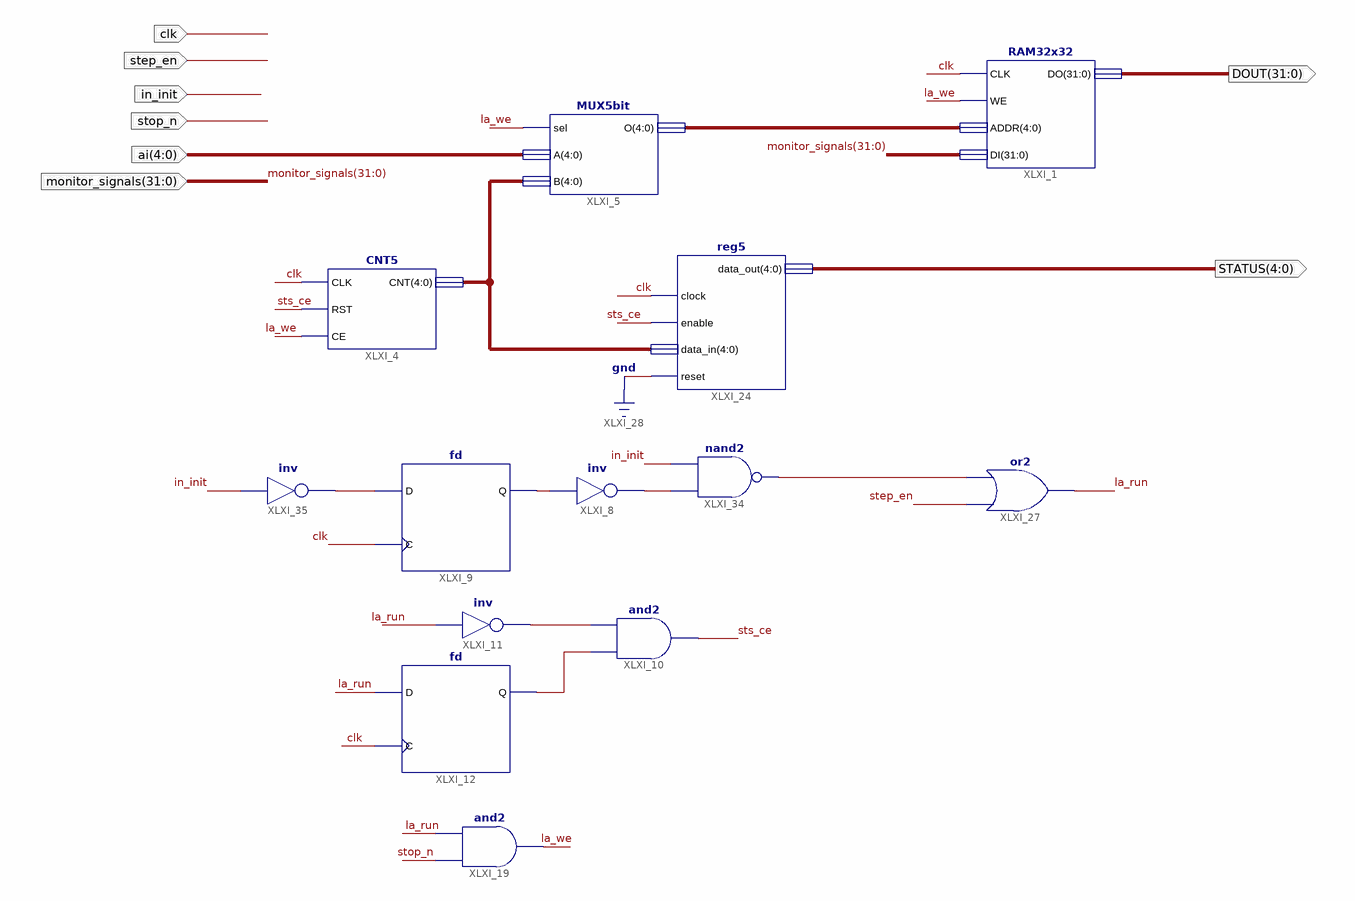
[diagram p0: schematic sheet 1]
// Xilinx ISE schematic LA.sch (spartan6) as structural Verilog: 13 symbols, 8 ports
module LA (
  input  in_init,
  input  step_en,
  input  [4:0] ai,
  input  stop_n,
  input  [31:0] monitor_signals,
  input  clk,
  output [31:0] DOUT,
  output [4:0] STATUS
);

  wire la_run, la_we, sts_ce, XLXN_31, XLXN_35, XLXN_41, XLXN_42, XLXN_63, XLXN_67;
  wire [4:0] XLXN_16, XLXN_17;

  RAM32x32 XLXI_1 (.CLK(clk), .WE(la_we), .ADDR(XLXN_17), .DI(monitor_signals), .DO(DOUT));
  CNT5 XLXI_4 (.CLK(clk), .RST(sts_ce), .CE(la_we), .CNT(XLXN_16));
  MUX5bit XLXI_5 (.sel(la_we), .A(ai), .B(XLXN_16), .O(XLXN_17));
  not XLXI_8 (XLXN_31, XLXN_35);
  fd XLXI_9 (.C(clk), .D(XLXN_67), .Q(XLXN_35));
  not XLXI_11 (XLXN_41, la_run);
  and XLXI_10 (sts_ce, XLXN_42, XLXN_41);
  fd XLXI_12 (.C(clk), .D(la_run), .Q(XLXN_42));
  reg5 XLXI_24 (.clock(clk), .enable(sts_ce), .data_in(XLXN_16), .data_out(STATUS), .reset(1'b0));
  and XLXI_19 (la_we, stop_n, la_run);
  or XLXI_27 (la_run, step_en, XLXN_63);
  nand XLXI_34 (XLXN_63, XLXN_31, in_init);
  not XLXI_35 (XLXN_67, in_init);
endmodule
